# Altium schematic sheet Ethernet.SchDoc
size A3
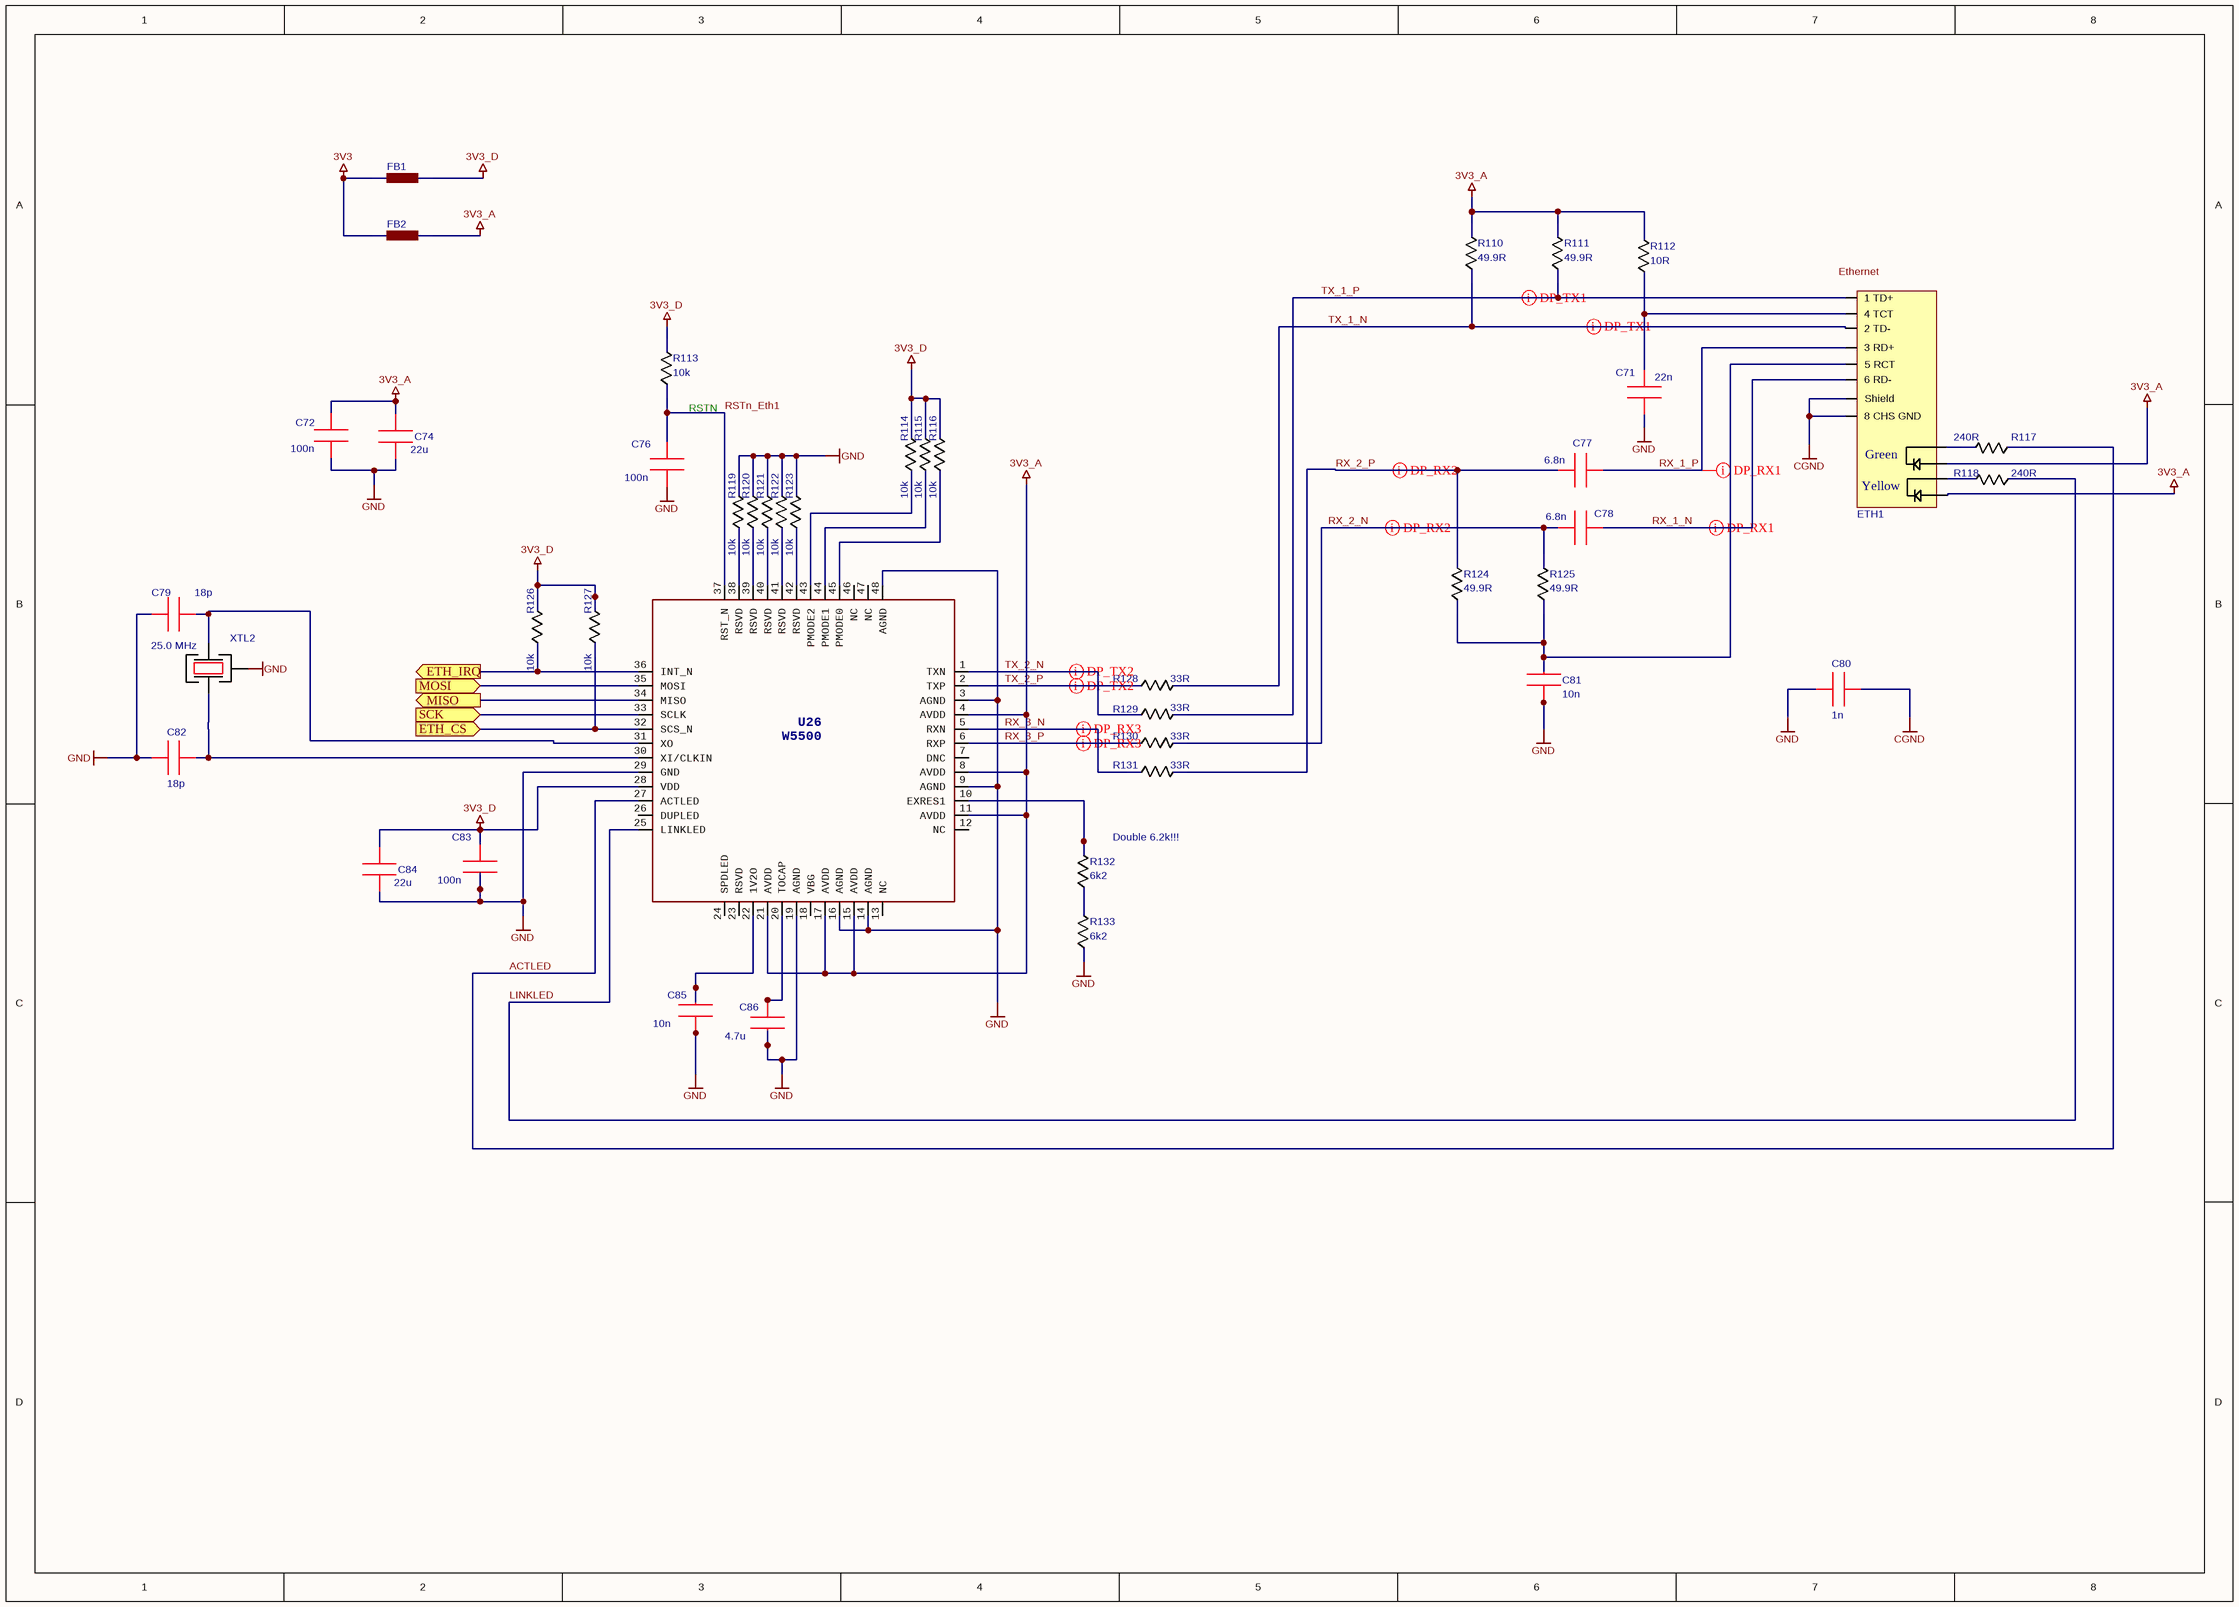
[diagram p0: Ethernet.SchDoc]

## Parts
C71  22n  [0603]
C72  100n  [0603]
C74  22u  [1206]
C76  100n  [0603]
C77  6.8n  [0603]
C78  6.8n  [0603]
C79  18p  [0603]
C80  1n  [1206]
C81  10n  [0603]
C82  18p  [0603]
C83  100n  [0603]
C84  22u  [1206]
C85  10n  [0603]
C86  4.7u  [0603]
ETH1  Ethernet RJ-45 Port  [J011D21BNL]  (value not drawn)
FB1  Ferrite Bead  [0805]  (value not drawn)
FB2  Ferrite Bead  [0805]  (value not drawn)
R110  49.9R  [0603]
R111  49.9R  [0603]
R112  10R  [0603]
R113  10k  [0603]
R114  10k  [0603]
R115  10k  [0603]
R116  10k  [0603]
R117  240R  [0603]
R118  240R  [0603]
R119  10k  [0603]
R120  10k  [0603]
R121  10k  [0603]
R122  10k  [0603]
R123  10k  [0603]
R124  49.9R  [0603]
R125  49.9R  [0603]
R126  10k  [0603]
R127  10k  [0603]
R128  33R  [0603]
R129  33R  [0603]
R130  33R  [0603]
R131  33R  [0603]
R132  6k2  [0603]
R133  6k2  [0603]
U26  W5500  [LQFP 48]
XTL2  25.0 MHz  [KX-7 XTAL]

## Ports
ETH_CS, ETH_IRQ, MISO, MOSI, SCK

## Nets
3V3: FB1.1 FB2.1
3V3_A: C72.1 C74.2 ETH1.9(LDGr) ETH1.12(LDYE) FB2.2 R110.2 R111.2 R112.2 U26.4(AVDD) U26.8(AVDD) U26.11(AVDD) U26.15(AVDD) U26.17(AVDD) U26.21(AVDD)
3V3_D: C83.1 C84.2 FB1.2 R113.2 R114.2 R115.2 R116.2 R126.2 R127.2 U26.28(VDD)
CGND: C80.2 ETH1.8(8_CHS_GND) ETH1.SHIELD(Shield)
GND: C71.2 C72.2 C74.1 C76.2 C79.1 C80.1 C81.2 C82.1 C83.2 C84.1 C85.2 C86.2 R119.2 R120.2 R121.2 R122.2 R123.2 R133.1 U26.3(AGND) U26.9(AGND) U26.14(AGND) U26.16(AGND) U26.19(AGND) U26.29(GND) U26.48(AGND) XTL2.2
ACTLED: R117.1 U26.27(ACTLED)
ETH_CS: R127.1 U26.32(SCS_N) ; port ETH_CS
ETH_IRQ: R126.1 U26.36(INT_N) ; port ETH_IRQ
LINKLED: R118.1 U26.25(LINKLED)
MISO: U26.34(MISO) ; port MISO
MOSI: U26.35(MOSI) ; port MOSI
RSTn_Eth1: C76.1 R113.1 U26.37(RST_N)
RX_1_N: C78.2 ETH1.6(6_RD-)
RX_1_P: C77.2 ETH1.3(3_RD+)
RX_2_N: C78.1 R125.2 R130.2
RX_2_P: C77.1 R124.2 R131.2
RX_3_N: R131.1 U26.5(RXN)
RX_3_P: R130.1 U26.6(RXP)
SCK: U26.33(SCLK) ; port SCK
TX_1_N: ETH1.2(2_TD-) R110.1 R128.2
TX_1_P: ETH1.1(1_TD+) R111.1 R129.2
TX_2_N: R129.1 U26.1(TXN)
TX_2_P: R128.1 U26.2(TXP)
NetC71_1: C71.1 ETH1.4(4_TCT) R112.1
NetC79_2: C79.2 U26.31(XO) XTL2.3
NetC81_1: C81.1 ETH1.5(5_RCT) R124.1 R125.1
NetC82_2: C82.2 U26.30(XI/CLKIN) XTL2.1
NetC85_1: C85.1 U26.22(1V2O)
NetC86_1: C86.1 U26.20(TOCAP)
NetETH1_10: ETH1.10(LDGr) R117.2
NetETH1_11: ETH1.11(LDYE) R118.2
NetR114_1: R114.1 U26.43(PMODE2)
NetR115_1: R115.1 U26.44(PMODE1)
NetR116_1: R116.1 U26.45(PMODE0)
NetR119_1: R119.1 U26.38(RSVD)
NetR120_1: R120.1 U26.39(RSVD)
NetR121_1: R121.1 U26.40(RSVD)
NetR122_1: R122.1 U26.41(RSVD)
NetR123_1: R123.1 U26.42(RSVD)
NetR132_1: R132.1 R133.2
NetR132_2: R132.2 U26.10(EXRES1)

Not connected (* = marked no-connect by the designer): U26 7(DNC) 12(NC) 13(NC) 18(VBG) 23(RSVD) 24(SPDLED) 26(DUPLED) 46(NC) 47(NC)

## Layout directives
differential pair: RX_1_N, RX_1_P, RX_2_N, RX_2_P, RX_3_N, RX_3_P, TX_1_N, TX_1_P, TX_2_N, TX_2_P

## Notes on the sheet
- (near ETH1) Ethernet
- (near R113) RSTN
- (near R132) Double 6.2k!!!
- (in symbol J0011D21BNL) Green; Yellow

## Library data of the parts
C71 = 0603 CAP: GRM188R71H223KA01D
C72 C76 C83 = 0603 CAP: CC0603KRX7R9BB104
C74 C84 = 0805 Cap: CC1206KKX5R8BB226
C77 C78 = 0603 CAP: CC0603KRX7R9BB682
C79 C82 = 0603 CAP: CC0603JRNPO9BN180
C80 = 0603 CAP: CC1206KKX7RDBB102
C81 C85 = 0603 CAP: CC0603JRX7R9BB103
C86 = 0603 CAP: GRM188R61A475KE15D
ETH1 = J0011D21BNL
FB1 FB2 = BLM21PG220SN1D
R110 R111 R124 R125 = 0603 RES: RC0603FR-0749R9
R112 = 0603 RES: RC0603FR-0710RL
R113-R116 R119-R123 R126 R127 = 0603 RES: RC0603FR-0710KL
R117 R118 = 0603 RES: RC0603FR-07240RL
R128-R131 = 0603 RES: RC0603FR-0733R
R132 R133 = 0603 RES: RC0603FR-076K2
XTL2 = KX-7: 12.88711